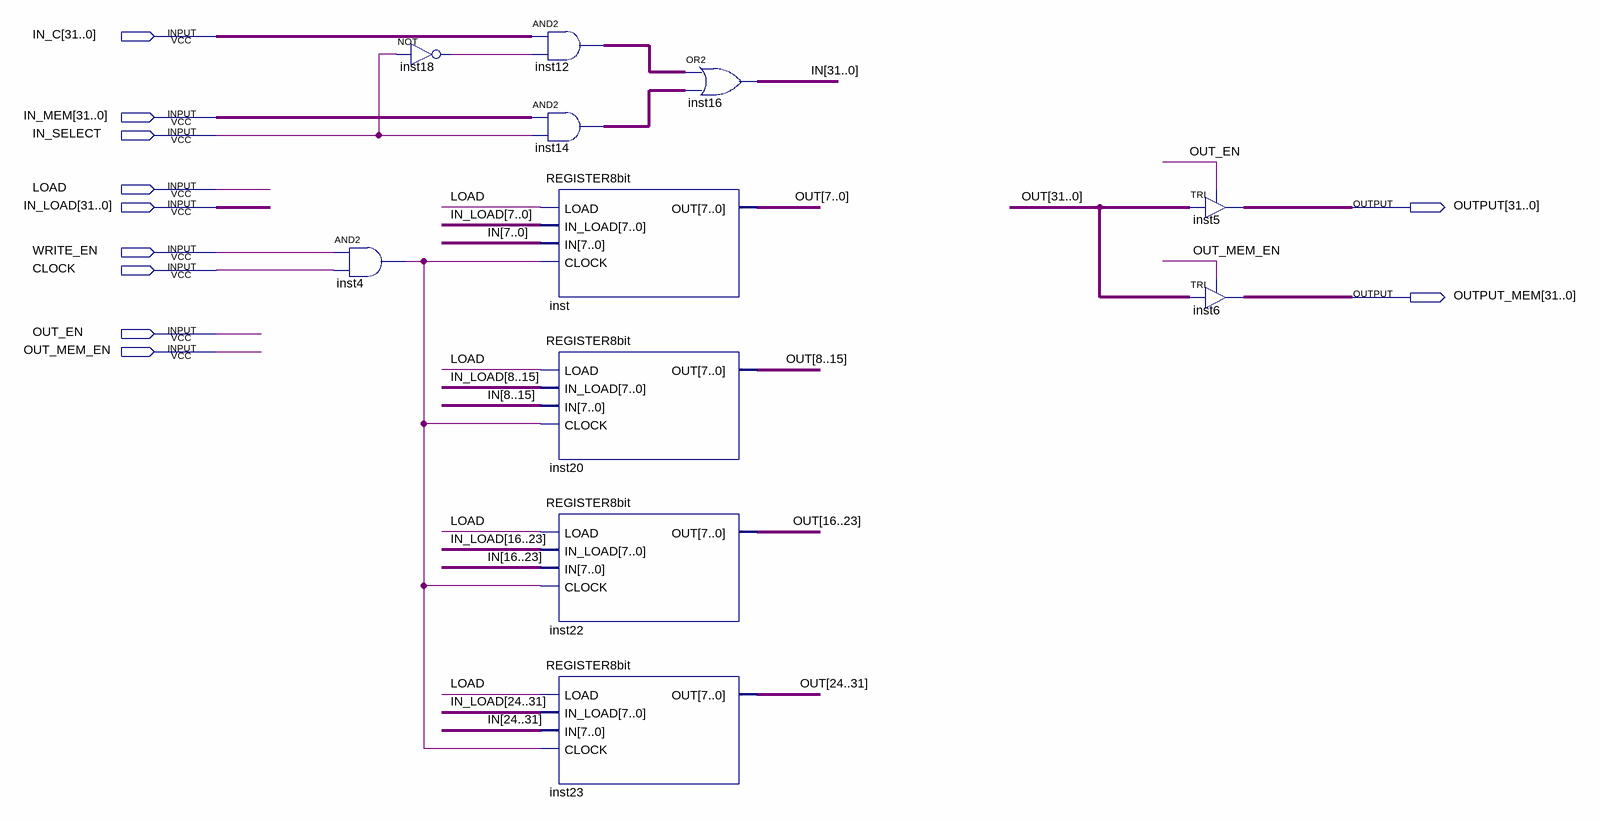
[diagram p0: schematic sheet]
// Quartus schematic REGISTER32bit.bdf as structural Verilog: 11 symbols, 11 pins
module REGISTER32bit (
  input  [31:0] IN_C,
  input  [31:0] IN_MEM,
  input  IN_SELECT,
  input  LOAD,
  input  [31:0] IN_LOAD,
  input  WRITE_EN,
  input  CLOCK,
  input  OUT_EN,
  input  OUT_MEM_EN,
  output [31:0] OUTPUT,
  output [31:0] OUTPUT_MEM
);

  wire inst4_out, inst18_out;
  wire [31:0] IN, inst12_out, inst14_out, OUT;

  and inst4 (inst4_out, WRITE_EN, CLOCK);
  not inst18 (inst18_out, IN_SELECT);
  assign inst12_out = IN_C & {32{inst18_out}};  // AND2 inst12, 32 bits wide
  assign inst14_out = IN_MEM & {32{IN_SELECT}};  // AND2 inst14, 32 bits wide
  REGISTER8bit inst (.LOAD(LOAD), .IN_LOAD(IN_LOAD[7:0]), .IN(IN[7:0]), .CLOCK(inst4_out), .OUT(OUT[7:0]));
  REGISTER8bit inst20 (
    .LOAD(LOAD),
    .IN_LOAD({IN_LOAD[8], IN_LOAD[9], IN_LOAD[10], IN_LOAD[11], IN_LOAD[12], IN_LOAD[13], IN_LOAD[14], IN_LOAD[15]}),
    .IN({IN[8], IN[9], IN[10], IN[11], IN[12], IN[13], IN[14], IN[15]}), .CLOCK(inst4_out),
    .OUT({OUT[8], OUT[9], OUT[10], OUT[11], OUT[12], OUT[13], OUT[14], OUT[15]}));
  REGISTER8bit inst22 (
    .LOAD(LOAD),
    .IN_LOAD({IN_LOAD[16], IN_LOAD[17], IN_LOAD[18], IN_LOAD[19], IN_LOAD[20], IN_LOAD[21], IN_LOAD[22], IN_LOAD[23]}),
    .IN({IN[16], IN[17], IN[18], IN[19], IN[20], IN[21], IN[22], IN[23]}), .CLOCK(inst4_out),
    .OUT({OUT[16], OUT[17], OUT[18], OUT[19], OUT[20], OUT[21], OUT[22], OUT[23]}));
  REGISTER8bit inst23 (
    .LOAD(LOAD),
    .IN_LOAD({IN_LOAD[24], IN_LOAD[25], IN_LOAD[26], IN_LOAD[27], IN_LOAD[28], IN_LOAD[29], IN_LOAD[30], IN_LOAD[31]}),
    .IN({IN[24], IN[25], IN[26], IN[27], IN[28], IN[29], IN[30], IN[31]}), .CLOCK(inst4_out),
    .OUT({OUT[24], OUT[25], OUT[26], OUT[27], OUT[28], OUT[29], OUT[30], OUT[31]}));
  assign IN = inst12_out | inst14_out;  // OR2 inst16, 32 bits wide
  TRI inst5[31:0] (.IN(OUT), .OE(OUT_EN), .OUT(OUTPUT));
  TRI inst6[31:0] (.IN(OUT), .OE(OUT_MEM_EN), .OUT(OUTPUT_MEM));
endmodule
